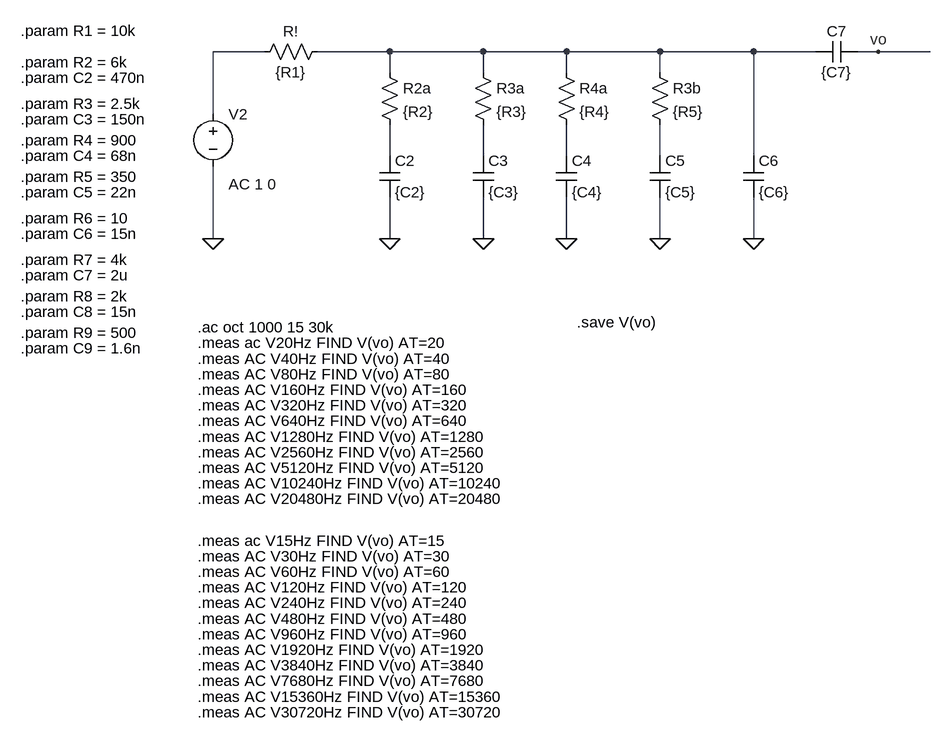
[diagram p0: schematic Project Draft.asc]
Project Draft.asc, the LTspice schematic file:
Version 4.1
SHEET 1 1440 856
WIRE 112 -176 32 -176
WIRE 304 -176 192 -176
WIRE 448 -176 304 -176
WIRE 576 -176 448 -176
WIRE 720 -176 576 -176
WIRE 864 -176 720 -176
WIRE 960 -176 864 -176
WIRE 1056 -176 1024 -176
WIRE 1136 -176 1056 -176
WIRE 304 -144 304 -176
WIRE 448 -144 448 -176
WIRE 576 -144 576 -176
WIRE 720 -144 720 -176
WIRE 32 -80 32 -176
WIRE 304 -16 304 -64
WIRE 448 -16 448 -64
WIRE 576 -16 576 -64
WIRE 720 -16 720 -64
WIRE 864 -16 864 -176
WIRE 32 112 32 0
WIRE 304 112 304 48
WIRE 448 112 448 48
WIRE 576 112 576 48
WIRE 720 112 720 48
WIRE 864 112 864 48
FLAG 32 112 0
FLAG 304 112 0
FLAG 1056 -176 vo
FLAG 448 112 0
FLAG 720 112 0
FLAG 576 112 0
FLAG 864 112 0
SYMBOL voltage 32 -96 R0
WINDOW 3 28 83 Left 2
WINDOW 123 24 124 Left 2
WINDOW 39 0 0 Left 0
SYMATTR Value ""
SYMATTR Value2 AC 1 0
SYMATTR InstName V2
SYMBOL res 208 -192 R90
WINDOW 0 0 56 VBottom 2
WINDOW 3 32 56 VTop 2
SYMATTR InstName R!
SYMATTR Value {R1}
SYMBOL cap 288 -16 R0
SYMATTR InstName C2
SYMATTR Value {C2}
SYMBOL res 288 -160 R0
SYMATTR InstName R2a
SYMATTR Value {R2}
SYMBOL cap 432 -16 R0
SYMATTR InstName C3
SYMATTR Value {C3}
SYMBOL cap 704 -16 R0
SYMATTR InstName C5
SYMATTR Value {C5}
SYMBOL res 432 -160 R0
SYMATTR InstName R3a
SYMATTR Value {R3}
SYMBOL res 704 -160 R0
SYMATTR InstName R3b
SYMATTR Value {R5}
SYMBOL cap 560 -16 R0
SYMATTR InstName C4
SYMATTR Value {C4}
SYMBOL res 560 -160 R0
SYMATTR InstName R4a
SYMATTR Value {R4}
SYMBOL cap 848 -16 R0
SYMATTR InstName C6
SYMATTR Value {C6}
SYMBOL cap 1024 -192 R90
WINDOW 0 0 32 VBottom 2
WINDOW 3 32 32 VTop 2
SYMATTR InstName C7
SYMATTR Value {C7}
TEXT 8 248 Left 2 !.ac oct 1000 15 30k
TEXT 8 272 Left 2 !.meas ac V20Hz FIND V(vo) AT=20
TEXT 8 296 Left 2 !.meas AC V40Hz FIND V(vo) AT=40
TEXT 8 320 Left 2 !.meas AC V80Hz FIND V(vo) AT=80
TEXT 8 344 Left 2 !.meas AC V160Hz FIND V(vo) AT=160
TEXT 8 368 Left 2 !.meas AC V320Hz FIND V(vo) AT=320
TEXT 8 392 Left 2 !.meas AC V640Hz FIND V(vo) AT=640
TEXT 8 416 Left 2 !.meas AC V1280Hz FIND V(vo) AT=1280
TEXT 8 440 Left 2 !.meas AC V2560Hz FIND V(vo) AT=2560
TEXT 8 464 Left 2 !.meas AC V5120Hz FIND V(vo) AT=5120
TEXT 8 488 Left 2 !.meas AC V10240Hz FIND V(vo) AT=10240
TEXT 8 512 Left 2 !.meas AC V20480Hz FIND V(vo) AT=20480
TEXT 8 576 Left 2 !.meas ac V15Hz FIND V(vo) AT=15
TEXT 8 600 Left 2 !.meas AC V30Hz FIND V(vo) AT=30
TEXT 8 624 Left 2 !.meas AC V60Hz FIND V(vo) AT=60
TEXT 8 648 Left 2 !.meas AC V120Hz FIND V(vo) AT=120
TEXT 8 672 Left 2 !.meas AC V240Hz FIND V(vo) AT=240
TEXT 8 696 Left 2 !.meas AC V480Hz FIND V(vo) AT=480
TEXT 8 720 Left 2 !.meas AC V960Hz FIND V(vo) AT=960
TEXT 8 744 Left 2 !.meas AC V1920Hz FIND V(vo) AT=1920
TEXT 8 768 Left 2 !.meas AC V3840Hz FIND V(vo) AT=3840
TEXT 8 792 Left 2 !.meas AC V7680Hz FIND V(vo) AT=7680
TEXT 8 816 Left 2 !.meas AC V15360Hz FIND V(vo) AT=15360
TEXT 8 840 Left 2 !.meas AC V30720Hz FIND V(vo) AT=30720
TEXT -264 -160 Left 2 !.param R2 = 6k
TEXT -264 -136 Left 2 !.param C2 = 470n
TEXT -264 -208 Left 2 !.param R1 = 10k
TEXT -264 -96 Left 2 !.param R3 = 2.5k
TEXT -264 -72 Left 2 !.param C3 = 150n
TEXT -264 -40 Left 2 !.param R4 = 900
TEXT -264 -16 Left 2 !.param C4 = 68n
TEXT 592 240 Left 2 !.save V(vo)
TEXT -264 16 Left 2 !.param R5 = 350
TEXT -264 40 Left 2 !.param C5 = 22n
TEXT -264 80 Left 2 !.param R6 = 10
TEXT -264 104 Left 2 !.param C6 = 15n
TEXT -264 144 Left 2 !.param R7 = 4k
TEXT -264 168 Left 2 !.param C7 = 2u
TEXT -264 200 Left 2 !.param R8 = 2k
TEXT -264 224 Left 2 !.param C8 = 15n
TEXT -264 256 Left 2 !.param R9 = 500
TEXT -264 280 Left 2 !.param C9 = 1.6n

The netlist it stands for:
* Project Draft.asc
V2 N001 0 AC 1 0
R! N002 N001 {R1}
C2 N003 0 {C2}
R2a N002 N003 {R2}
C3 N004 0 {C3}
C5 N006 0 {C5}
R3a N002 N004 {R3}
R3b N002 N006 {R5}
C4 N005 0 {C4}
R4a N002 N005 {R4}
C6 N002 0 {C6}
C7 vo N002 {C7}
.ac oct 1000 15 30k
.meas ac V20Hz FIND V(vo) AT=20
.meas AC V40Hz FIND V(vo) AT=40
.meas AC V80Hz FIND V(vo) AT=80
.meas AC V160Hz FIND V(vo) AT=160
.meas AC V320Hz FIND V(vo) AT=320
.meas AC V640Hz FIND V(vo) AT=640
.meas AC V1280Hz FIND V(vo) AT=1280
.meas AC V2560Hz FIND V(vo) AT=2560
.meas AC V5120Hz FIND V(vo) AT=5120
.meas AC V10240Hz FIND V(vo) AT=10240
.meas AC V20480Hz FIND V(vo) AT=20480
.meas ac V15Hz FIND V(vo) AT=15
.meas AC V30Hz FIND V(vo) AT=30
.meas AC V60Hz FIND V(vo) AT=60
.meas AC V120Hz FIND V(vo) AT=120
.meas AC V240Hz FIND V(vo) AT=240
.meas AC V480Hz FIND V(vo) AT=480
.meas AC V960Hz FIND V(vo) AT=960
.meas AC V1920Hz FIND V(vo) AT=1920
.meas AC V3840Hz FIND V(vo) AT=3840
.meas AC V7680Hz FIND V(vo) AT=7680
.meas AC V15360Hz FIND V(vo) AT=15360
.meas AC V30720Hz FIND V(vo) AT=30720
.param R2 = 6k
.param C2 = 470n
.param R1 = 10k
.param R3 = 2.5k
.param C3 = 150n
.param R4 = 900
.param C4 = 68n
.save V(vo)
.param R5 = 350
.param C5 = 22n
.param R6 = 10
.param C6 = 15n
.param R7 = 4k
.param C7 = 2u
.param R8 = 2k
.param C8 = 15n
.param R9 = 500
.param C9 = 1.6n
.backanno
.end